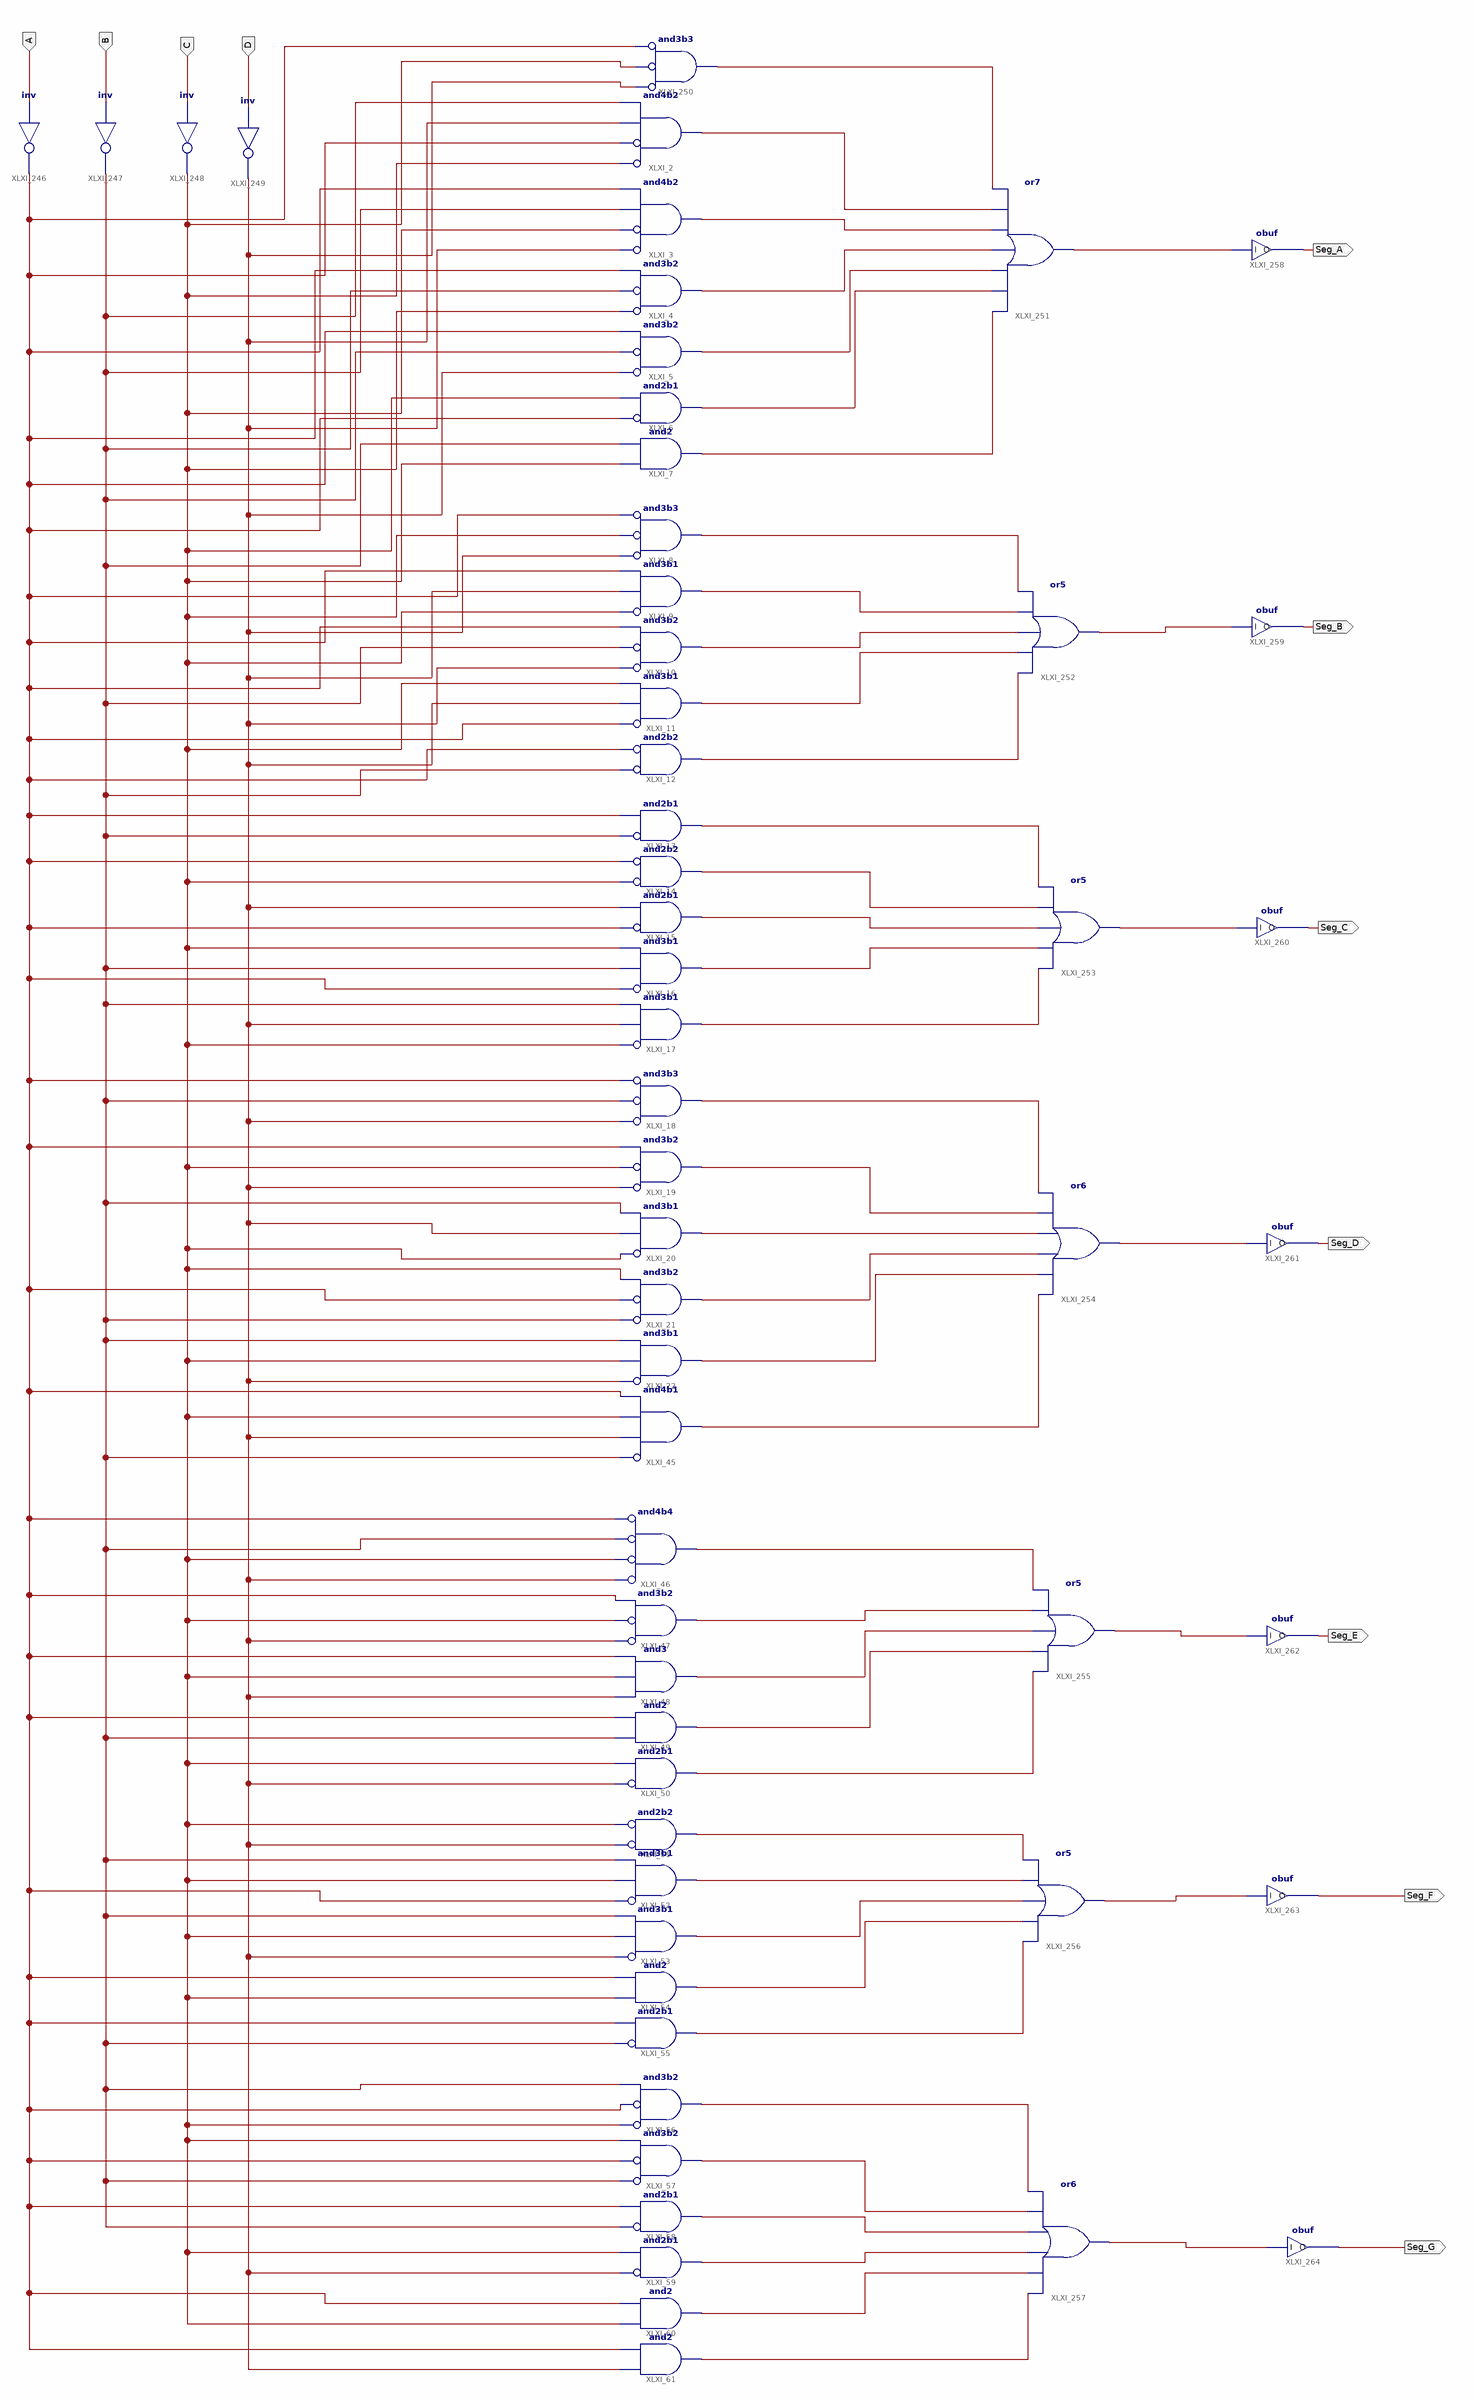
[diagram p0: schematic sheet 1]
// Xilinx ISE schematic section4.sch (xc9500xl) as structural Verilog: 57 symbols, 11 ports
module section4 (
  input  A,
  input  B,
  input  C,
  input  D,
  output Seg_G,
  output Seg_F,
  output Seg_D,
  output Seg_E,
  output Seg_C,
  output Seg_B,
  output Seg_A
);

  wire XLXN_24, XLXN_25, XLXN_27, XLXN_29, XLXN_30, XLXN_31, XLXN_32, XLXN_33, XLXN_34, XLXN_35, XLXN_36,
       XLXN_37, XLXN_38, XLXN_40, XLXN_41, XLXN_42, XLXN_43, XLXN_44, XLXN_45, XLXN_46, XLXN_47, XLXN_48,
       XLXN_49, XLXN_50, XLXN_51, XLXN_52, XLXN_53, XLXN_54, XLXN_55, XLXN_56, XLXN_57, XLXN_58, XLXN_59,
       XLXN_60, XLXN_61, XLXN_62, XLXN_63, XLXN_65, XLXN_66, XLXN_67, XLXN_68, XLXN_69, XLXN_70, XLXN_72,
       XLXN_73, XLXN_74, XLXN_75, XLXN_76, XLXN_77, XLXN_78;

  and XLXI_2 (XLXN_31, ~XLXN_27, ~XLXN_29, XLXN_24, XLXN_25);  // and4b2
  and XLXI_3 (XLXN_32, ~XLXN_24, ~XLXN_27, XLXN_25, XLXN_29);  // and4b2
  and XLXI_4 (XLXN_33, ~XLXN_27, ~XLXN_25, XLXN_29);  // and3b2
  and XLXI_5 (XLXN_34, ~XLXN_24, ~XLXN_25, XLXN_29);  // and3b2
  and XLXI_6 (XLXN_35, ~XLXN_29, XLXN_27);  // and2b1
  and XLXI_7 (XLXN_36, XLXN_27, XLXN_25);
  and XLXI_8 (XLXN_37, ~XLXN_24, ~XLXN_27, ~XLXN_29);  // and3b3
  and XLXI_9 (XLXN_38, ~XLXN_27, XLXN_24, XLXN_29);  // and3b1
  and XLXI_10 (XLXN_40, ~XLXN_24, ~XLXN_25, XLXN_29);  // and3b2
  and XLXI_11 (XLXN_41, ~XLXN_29, XLXN_24, XLXN_27);  // and3b1
  and XLXI_12 (XLXN_42, ~XLXN_25, ~XLXN_29);  // and2b2
  and XLXI_13 (XLXN_43, ~XLXN_25, XLXN_29);  // and2b1
  and XLXI_14 (XLXN_44, ~XLXN_27, ~XLXN_29);  // and2b2
  and XLXI_15 (XLXN_45, ~XLXN_29, XLXN_24);  // and2b1
  and XLXI_16 (XLXN_46, ~XLXN_29, XLXN_25, XLXN_27);  // and3b1
  and XLXI_17 (XLXN_47, ~XLXN_27, XLXN_24, XLXN_25);  // and3b1
  and XLXI_18 (XLXN_48, ~XLXN_24, ~XLXN_25, ~XLXN_29);  // and3b3
  and XLXI_19 (XLXN_49, ~XLXN_24, ~XLXN_27, XLXN_29);  // and3b2
  and XLXI_20 (XLXN_50, ~XLXN_27, XLXN_24, XLXN_25);  // and3b1
  and XLXI_21 (XLXN_51, ~XLXN_25, ~XLXN_29, XLXN_27);  // and3b2
  and XLXI_22 (XLXN_52, ~XLXN_24, XLXN_27, XLXN_25);  // and3b1
  and XLXI_45 (XLXN_53, ~XLXN_25, XLXN_24, XLXN_27, XLXN_29);  // and4b1
  and XLXI_46 (XLXN_54, ~XLXN_24, ~XLXN_27, ~XLXN_25, ~XLXN_29);  // and4b4
  and XLXI_47 (XLXN_55, ~XLXN_24, ~XLXN_27, XLXN_29);  // and3b2
  and XLXI_48 (XLXN_56, XLXN_24, XLXN_27, XLXN_29);
  and XLXI_49 (XLXN_57, XLXN_25, XLXN_29);
  and XLXI_50 (XLXN_58, ~XLXN_24, XLXN_27);  // and2b1
  and XLXI_51 (XLXN_59, ~XLXN_24, ~XLXN_27);  // and2b2
  and XLXI_52 (XLXN_60, ~XLXN_29, XLXN_27, XLXN_25);  // and3b1
  and XLXI_53 (XLXN_61, ~XLXN_24, XLXN_27, XLXN_25);  // and3b1
  and XLXI_54 (XLXN_62, XLXN_27, XLXN_29);
  and XLXI_55 (XLXN_63, ~XLXN_25, XLXN_29);  // and2b1
  and XLXI_56 (XLXN_65, ~XLXN_27, ~XLXN_29, XLXN_25);  // and3b2
  and XLXI_57 (XLXN_66, ~XLXN_25, ~XLXN_29, XLXN_27);  // and3b2
  and XLXI_58 (XLXN_67, ~XLXN_25, XLXN_29);  // and2b1
  and XLXI_59 (XLXN_68, ~XLXN_24, XLXN_27);  // and2b1
  and XLXI_60 (XLXN_69, XLXN_27, XLXN_29);
  and XLXI_61 (XLXN_70, XLXN_24, XLXN_29);
  not XLXI_246 (XLXN_29, A);
  not XLXI_247 (XLXN_25, B);
  not XLXI_248 (XLXN_27, C);
  not XLXI_249 (XLXN_24, D);
  and XLXI_250 (XLXN_30, ~XLXN_24, ~XLXN_27, ~XLXN_29);  // and3b3
  or XLXI_251 (XLXN_72, XLXN_36, XLXN_35, XLXN_34, XLXN_33, XLXN_32, XLXN_31, XLXN_30);
  or XLXI_252 (XLXN_73, XLXN_42, XLXN_41, XLXN_40, XLXN_38, XLXN_37);
  or XLXI_253 (XLXN_74, XLXN_47, XLXN_46, XLXN_45, XLXN_44, XLXN_43);
  or XLXI_254 (XLXN_75, XLXN_53, XLXN_52, XLXN_51, XLXN_50, XLXN_49, XLXN_48);
  or XLXI_255 (XLXN_76, XLXN_58, XLXN_57, XLXN_56, XLXN_55, XLXN_54);
  or XLXI_256 (XLXN_77, XLXN_63, XLXN_62, XLXN_61, XLXN_60, XLXN_59);
  or XLXI_257 (XLXN_78, XLXN_70, XLXN_69, XLXN_68, XLXN_67, XLXN_66, XLXN_65);
  obuf XLXI_258 (.I(XLXN_72), .O(Seg_A));
  obuf XLXI_259 (.I(XLXN_73), .O(Seg_B));
  obuf XLXI_260 (.I(XLXN_74), .O(Seg_C));
  obuf XLXI_261 (.I(XLXN_75), .O(Seg_D));
  obuf XLXI_262 (.I(XLXN_76), .O(Seg_E));
  obuf XLXI_263 (.I(XLXN_77), .O(Seg_F));
  obuf XLXI_264 (.I(XLXN_78), .O(Seg_G));
endmodule
